# Altium schematic sheet ESP8266_Core.SchDoc
size A; Author: Erick Miranda Quinde; DrawnBy: Erick Miranda Quinde; DocumentNumber: 0000-0000-0002; Revision: V1.0; SheetNumber: 2; SheetTotal: 4
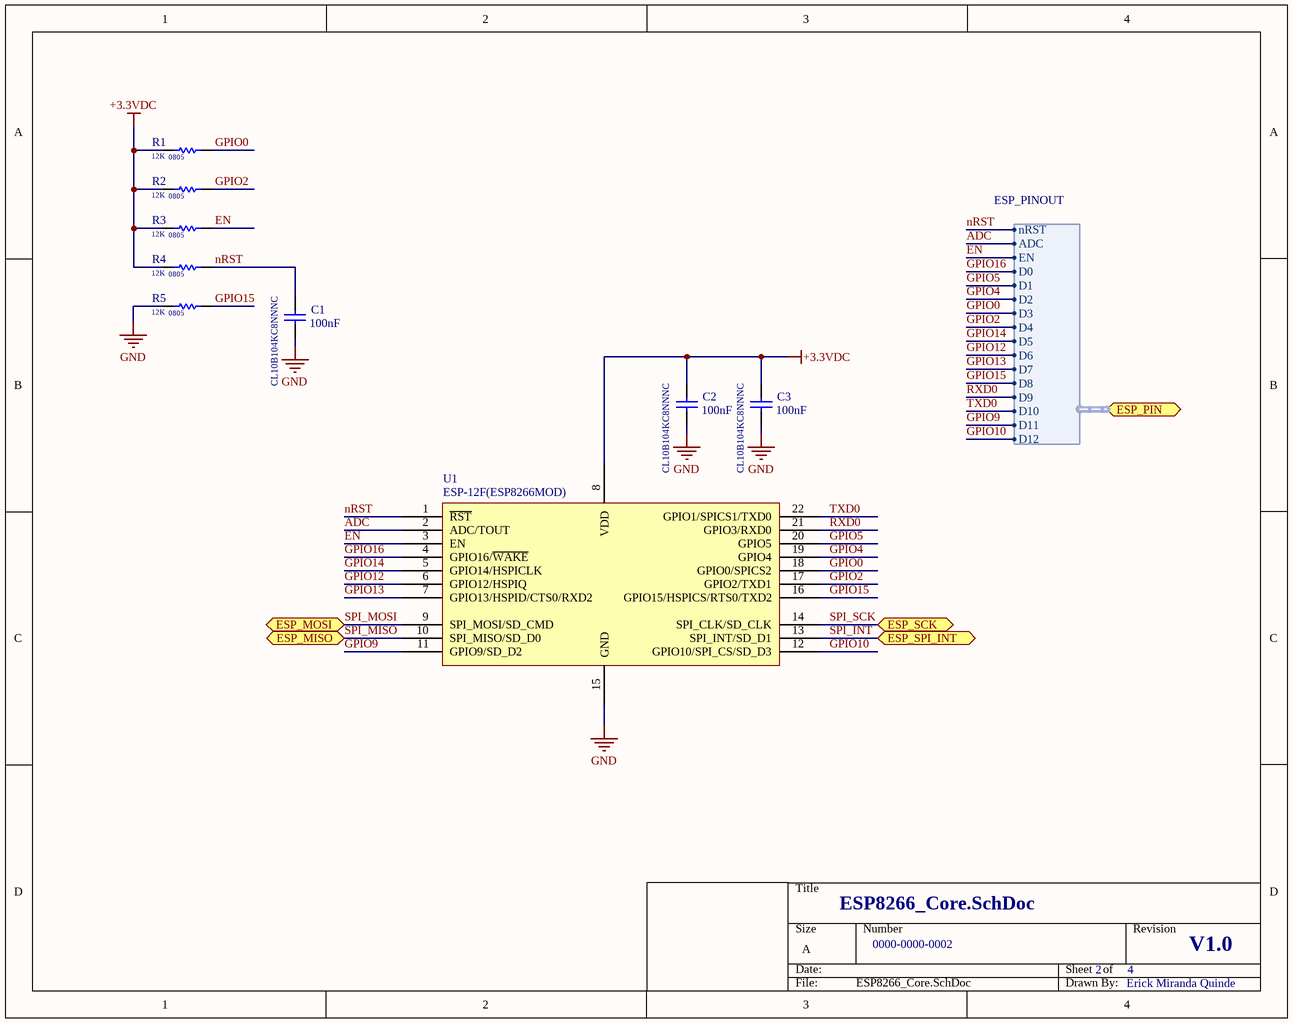
[diagram p0: ESP8266_Core.SchDoc]

## Parts
C1  CL10B104KC8NNNC  value 100nF  [C0603C104K5RACTU]
C2  CL10B104KC8NNNC  value 100nF  [C0603C104K5RACTU]
C3  CL10B104KC8NNNC  value 100nF  [C0603C104K5RACTU]
R1  value 12K  Package: 0805  [RES-0805]  (hidden comment: ERJ6RBD1202V)
R2  value 12K  Package: 0805  [RES-0805]  (hidden comment: ERJ6RBD1202V)
R3  value 12K  Package: 0805  [RES-0805]  (hidden comment: ERJ6RBD1202V)
R4  value 12K  Package: 0805  [RES-0805]  (hidden comment: ERJ6RBD1202V)
R5  value 12K  Package: 0805  [RES-0805]  (hidden comment: ERJ6RBD1202V)
U1  ESP-12F(ESP8266MOD)  [ESP-12E&F Module]

## Ports
ESP_MISO, ESP_MOSI, ESP_PIN (harness ESP_PINOUT), ESP_SCK, ESP_SPI_INT

## Harnesses
ESP_PINOUT: nRST, ADC, EN, D0, D1, D2, D3, D4, D5, D6, D7, D8, D9, D10, D11, D12

## Nets
+3.3VDC: C2.2 C3.2 R1.1 R2.1 R3.1 R4.1 U1.8(VDD)
GND: C1.1 C2.1 C3.1 R5.1 U1.15(GND)
ADC: U1.2(ADC/TOUT) ; port ESP_PIN.ADC
EN: R3.2 U1.3(EN) ; port ESP_PIN.EN
GPIO0: R1.2 U1.18(GPIO0/SPICS2) ; port ESP_PIN.D3
GPIO2: R2.2 U1.17(GPIO2/TXD1) ; port ESP_PIN.D4
GPIO4: U1.19(GPIO4) ; port ESP_PIN.D2
GPIO5: U1.20(GPIO5) ; port ESP_PIN.D1
GPIO9: U1.11(GPIO9/SD_D2) ; port ESP_PIN.D11
GPIO10: U1.12(GPIO10/SPI_CS/SD_D3) ; port ESP_PIN.D12
GPIO12: U1.6(GPIO12/HSPIQ) ; port ESP_PIN.D6
GPIO13: U1.7(GPIO13/HSPID/CTS0/RXD2) ; port ESP_PIN.D7
GPIO14: U1.5(GPIO14/HSPICLK) ; port ESP_PIN.D5
GPIO15: R5.2 U1.16(GPIO15/HSPICS/RTS0/TXD2) ; port ESP_PIN.D8
GPIO16: U1.4(GPIO16/~{WAKE}) ; port ESP_PIN.D0
nRST: C1.2 R4.2 U1.1(~{RST}) ; port ESP_PIN.nRST
RXD0: U1.21(GPIO3/RXD0) ; port ESP_PIN.D9
SPI_INT: U1.13(SPI_INT/SD_D1) ; port ESP_SPI_INT
SPI_MISO: U1.10(SPI_MISO/SD_D0) ; port ESP_MISO
SPI_MOSI: U1.9(SPI_MOSI/SD_CMD) ; port ESP_MOSI
SPI_SCK: U1.14(SPI_CLK/SD_CLK) ; port ESP_SCK
TXD0: U1.22(GPIO1/SPICS1/TXD0) ; port ESP_PIN.D10

## Library data of the parts
C1-C3 = Cap 100nF (0603): PART_NUM: CL10B104KC8NNNC; Price: $0.02; Link Store: https://lcsc.com/product-detail/Multilayer-Ceramic-Capacitors-MLCC-SMD-SMT_SAMSUNG_CL10B104KC8NNNC_100nF-104-10-100V_C15725.html
  C1: LCSC PArt: C15725
  C2 C3: LCSC Part: C15725
R1-R5 = Resistor: Published: 8-Jun-2000; LatestRevisionDate: 17-Jul-2002; LatestRevisionNote: Re-released for DXP Platform.; PackageReference: AXIAL-0.3; Publisher: Altium Limited; PackageDescription: Axial Device, Thru-Hole; 2 Leads; 0.3 in Pin Spacing; Price: $0.021; Link Store: https://lcsc.com/product-detail/Others_PANASONIC-ERJ6RBD1202V_C336850.html; LCSC Part: C336850
U1 = ESP-12E&F Module: Price: $1.9; Link Store: https://lcsc.com/product-detail/WIFI-Modules_ESP-12F-ESP8266MOD_C82891.html; LCSC Part: C82891